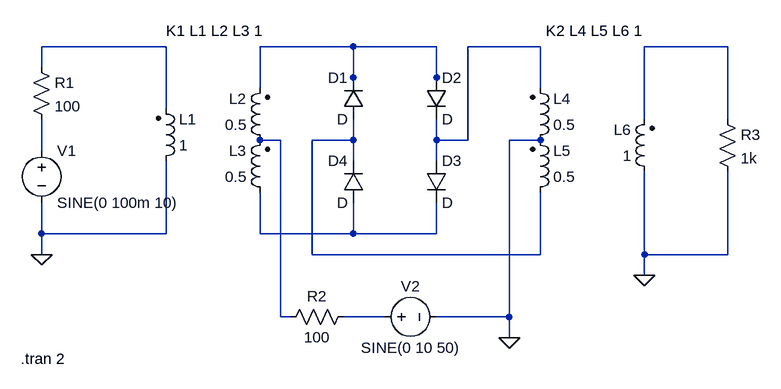
[diagram p0: schematic mod_anello_dopp_bil.asc]
mod_anello_dopp_bil.asc, the LTspice schematic file:
Version 4
SHEET 1 880 680
WIRE -80 -48 -272 -48
WIRE 208 -48 64 -48
WIRE 336 -48 208 -48
WIRE 496 -48 384 -48
WIRE 784 -48 656 -48
WIRE -272 -16 -272 -48
WIRE 208 0 208 -48
WIRE 336 0 336 -48
WIRE 64 16 64 -48
WIRE 208 16 208 0
WIRE 336 16 336 0
WIRE 496 16 496 -48
WIRE -80 48 -80 -48
WIRE 656 64 656 -48
WIRE 784 64 784 -48
WIRE 96 96 64 96
WIRE 208 96 208 64
WIRE 208 96 144 96
WIRE 336 96 336 64
WIRE 384 96 384 -48
WIRE 384 96 336 96
WIRE 496 96 448 96
WIRE -272 112 -272 64
WIRE 208 128 208 96
WIRE 336 128 336 96
WIRE -272 240 -272 192
WIRE -80 240 -80 128
WIRE -80 240 -272 240
WIRE 64 240 64 176
WIRE 208 240 208 192
WIRE 208 240 64 240
WIRE 336 240 336 192
WIRE 336 240 208 240
WIRE -272 272 -272 240
WIRE 144 272 144 96
WIRE 496 272 496 176
WIRE 496 272 144 272
WIRE 656 272 656 144
WIRE 784 272 784 144
WIRE 784 272 656 272
WIRE 656 304 656 272
WIRE 96 368 96 96
WIRE 112 368 96 368
WIRE 256 368 192 368
WIRE 448 368 448 96
WIRE 448 368 336 368
WIRE 448 400 448 368
FLAG -272 272 0
FLAG 656 304 0
FLAG 448 400 0
SYMBOL voltage -272 96 R0
WINDOW 123 0 0 Left 2
WINDOW 39 0 0 Left 2
SYMATTR InstName V1
SYMATTR Value SINE(0 100m 10)
SYMBOL voltage 240 368 R270
WINDOW 0 32 56 VTop 2
WINDOW 3 -32 56 VBottom 2
WINDOW 123 0 0 Left 2
WINDOW 39 0 0 Left 2
SYMATTR InstName V2
SYMATTR Value SINE(0 10 50)
SYMBOL diode 224 64 R180
WINDOW 0 24 64 Left 2
WINDOW 3 24 0 Left 2
SYMATTR InstName D1
SYMBOL diode 320 0 R0
SYMATTR InstName D2
SYMBOL diode 320 128 R0
SYMATTR InstName D3
SYMBOL diode 224 192 R180
WINDOW 0 24 64 Left 2
WINDOW 3 24 0 Left 2
SYMATTR InstName D4
SYMBOL ind2 -96 144 M180
WINDOW 0 36 80 Left 2
WINDOW 3 36 40 Left 2
SYMATTR InstName L1
SYMATTR Value 1
SYMATTR Type ind
SYMBOL ind2 80 112 R180
WINDOW 0 36 80 Left 2
WINDOW 3 36 40 Left 2
SYMATTR InstName L2
SYMATTR Value 0.5
SYMATTR Type ind
SYMBOL ind2 80 192 R180
WINDOW 0 36 80 Left 2
WINDOW 3 36 40 Left 2
SYMATTR InstName L3
SYMATTR Value 0.5
SYMATTR Type ind
SYMBOL res -288 -32 R0
SYMATTR InstName R1
SYMATTR Value 100
SYMBOL res 208 352 R90
WINDOW 0 0 56 VBottom 2
WINDOW 3 32 56 VTop 2
SYMATTR InstName R2
SYMATTR Value 100
SYMBOL ind2 480 112 M180
WINDOW 0 36 80 Left 2
WINDOW 3 36 40 Left 2
SYMATTR InstName L4
SYMATTR Value 0.5
SYMATTR Type ind
SYMBOL ind2 480 192 M180
WINDOW 0 36 80 Left 2
WINDOW 3 36 40 Left 2
SYMATTR InstName L5
SYMATTR Value 0.5
SYMATTR Type ind
SYMBOL ind2 672 160 R180
WINDOW 0 36 80 Left 2
WINDOW 3 36 40 Left 2
SYMATTR InstName L6
SYMATTR Value 1
SYMATTR Type ind
SYMBOL res 768 48 R0
SYMATTR InstName R3
SYMATTR Value 1k
TEXT -80 -72 Left 2 !K1 L1 L2 L3 1
TEXT 504 -72 Left 2 !K2 L4 L5 L6 1
TEXT -304 432 Left 2 !.tran 2

The netlist it stands for:
* mod_anello_dopp_bil.asc
V1 N007 0 SINE(0 100m 10)
V2 N009 0 SINE(0 10 50)
D1 N006 N002 D
D2 N002 N003 D
D3 N003 N008 D
D4 N008 N006 D
L1 0 N001 1
L2 N005 N002 0.5
L3 N008 N005 0.5
R1 N001 N007 100
R2 N009 N005 100
L4 0 N003 0.5
L5 N006 0 0.5
L6 0 N004 1
R3 N004 0 1k
.model D D
.lib standard.dio
K1 L1 L2 L3 1
K2 L4 L5 L6 1
.tran 2
.backanno
.end